# EasyEDA Pro project tumkibot1_servo_driver.eprj

# Schematic Schematic1
Board Name: Board1; Create Date: 2025-09-21; Page Name: P1; Project Name: tumkibot1_servo_driver; Schematic Name: Schematic1; Update Date: 2025-09-22; Company: EasyEDA.com; Page Size: A4; Version: V1.0
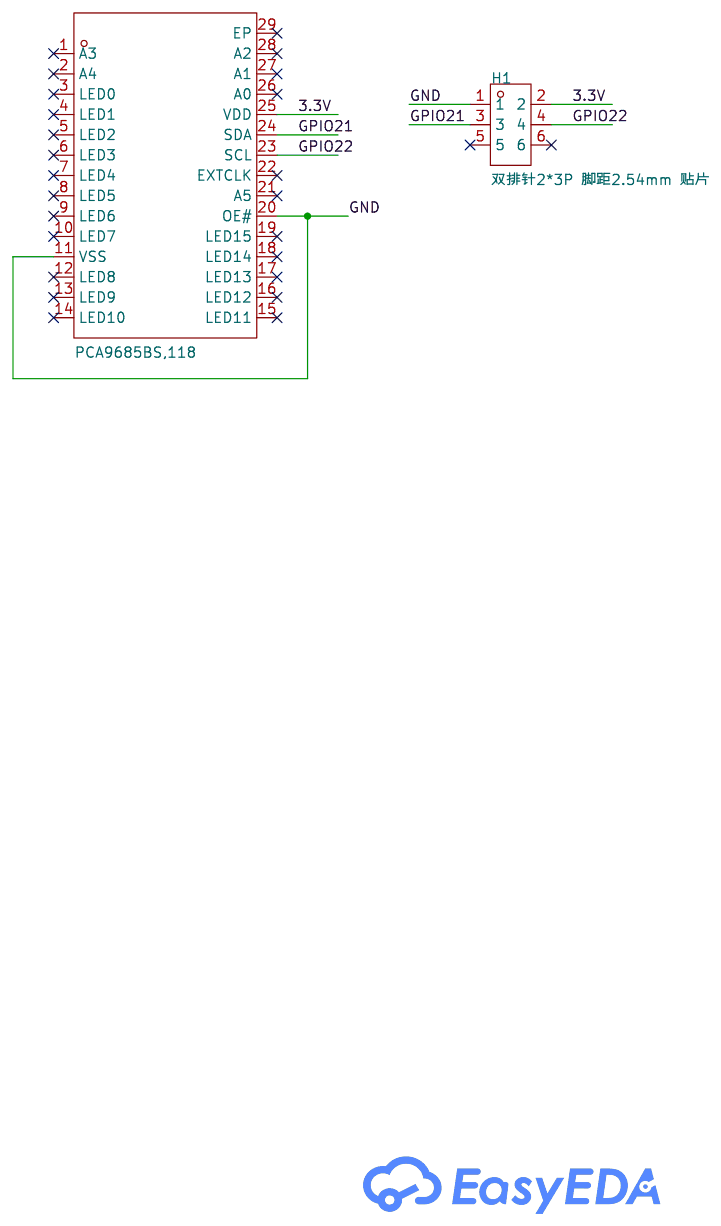
[diagram p0: schematic sheet]

## Parts
H1  双排针2*3P 脚距2.54mm 贴片  [HDR-SMD_6P-P2.54-V-M-R2-C3-S2.54-LS7.4]
U1  PCA9685BS,118  [QFN-28_L6.0-W6.0-P0.65-TL-EP4.1]

## Library data of the parts
H1 = 双排针2*3P 脚距2.54mm 贴片: LCSC Part Name: 间距:2.54mm; Supplier Part: C77761; Manufacturer: BOOMELE(博穆精密); Supplier Footprint: SMD,P=2.54mm; JLCPCB Part Class: Extended Part; Supplier: LCSC; Pitch: 2.54mm; Row Spacing: 2.54mm; Number of Rows: 2; Number of Pins: 6P; Color: Black
U1 = PCA9685BS,118: LCSC Part Name: 16通道、12位PWM Fm+ I2C总线LED控制器; Supplier Part: C5191634; Manufacturer: NXP(恩智浦); Supplier Footprint: HVQFN-28(6x6); JLCPCB Part Class: Extended Part; Datasheet: https://www.nxp.com.cn/docs/en/data-sheet/PCA9685.pdf; Supplier: LCSC; Voltage - Input(DC): 2.3V~5.5V; Number of Channels: 16; Output Current: 25mA; Dimming: PWM；I2C; Operating temperature: -40℃~+85℃

## Nets
3.3V: H1.2 U1.25(VDD)
GND: H1.1 U1.11(VSS) U1.20(OE#)
GPIO21: H1.3 U1.24(SDA)
GPIO22: H1.4 U1.23(SCL)

Not connected (* = marked no-connect by the designer): H1 5* 6*; U1 1(A3)* 2(A4)* 3(LED0)* 4(LED1)* 5(LED2)* 6(LED3)* 7(LED4)* 8(LED5)* 9(LED6)* 10(LED7)* 12(LED8)* 13(LED9)* 14(LED10)* 15(LED11)* 16(LED12)* 17(LED13)* 18(LED14)* 19(LED15)* 21(A5)* 22(EXTCLK)* 26(A0)* 27(A1)* 28(A2)* 29(EP)*

# Board PCB1
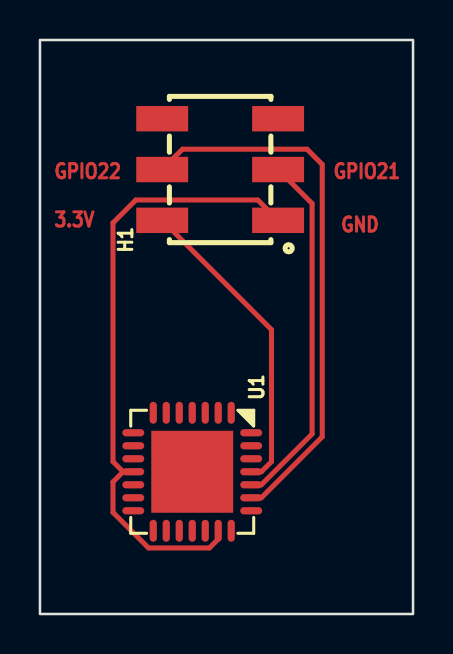
[diagram p1: board, top side]
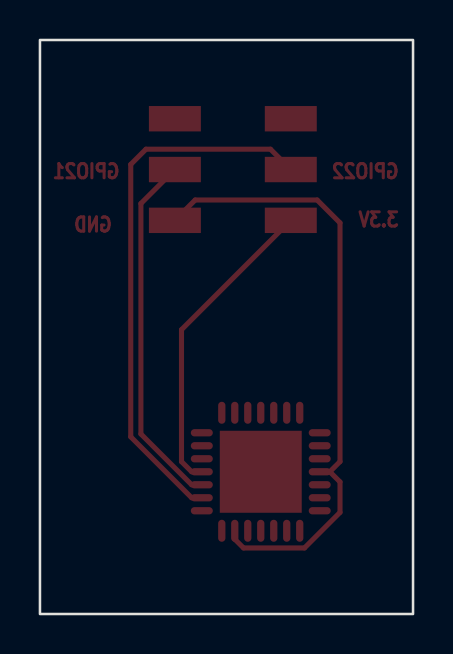
[diagram p2: board, bottom side, seen from below]

Outline 18.67 x 28.7 mm; copper layers: Top Layer, Bottom Layer. Coordinates in mm from the lower left corner of the outline.
Outline path: rectangle 0,28.7 18.67,0
Stack: Top Layer 0.035mm / Dielectric1 1.51mm FR4 er 4.5 / Bottom Layer 0.035mm

## Design rules (mm)
template: JLCPCB Capability(Two Layers Board)
spacing copperThickness1oz (default): track to track 0.102, other pairs 0.152 to 0.3
spacing copperThickness2oz: track to track 0.203, other pairs 0.152 to 0.3
track width copperThickness1oz (default): min 0.127, default 0.254, max 2.54
track width copperThickness2oz: min 0.203, default 0.254, max 2.54
differential pair differentialPair (default): width min 0.127, default 0.254, max 2.54; gap min 0.152, default 0.152
via viaSize (default): diameter min 0.5, default 0.61, max 10; hole min 0.3, default 0.305, max 6.3

## Placement (name value [footprint] x y rotation side)
H1  双排针2*3P 脚距2.54mm 贴片  [HDR-SMD_6P-P2.54-V-M-R2-C3-S2.54-LS7.4]  9.02 22.22 90 top
U1  PCA9685BS,118  [QFN-28_L6.0-W6.0-P0.65-TL-EP4.1]  7.62 7.11 270 top

## Footprints (pads in the part's own frame, mm; a bottom-side part is the same pattern mirrored in y, then rotated)
HDR-SMD_6P-P2.54-V-M-R2-C3-S2.54-LS7.4
  rect 1.27x2.6 smd: 1(-2.54,-2.9) 2(-2.54,2.9) 3(0,-2.9) 4(0,2.9) 5(2.54,-2.9) 6(2.54,2.9)
QFN-28_L6.0-W6.0-P0.65-TL-EP4.1
  oval 1.1x0.364 smd: 1(-2.95,1.95) 2(-2.95,1.3) 3(-2.95,0.65) 4(-2.95,0) 5(-2.95,-0.65) 6(-2.95,-1.3) 7(-2.95,-1.95) 15(2.95,-1.95) 16(2.95,-1.3) 17(2.95,-0.65) 18(2.95,0) 19(2.95,0.65) 20(2.95,1.3) 21(2.95,1.95)
  oval 0.364x1.1 smd: 8(-1.95,-2.95) 9(-1.3,-2.95) 10(-0.65,-2.95) 11(0,-2.95) 12(0.65,-2.95) 13(1.3,-2.95) 14(1.95,-2.95) 22(1.95,2.95) 23(1.3,2.95) 24(0.65,2.95) 25(0,2.95) 26(-0.65,2.95) 27(-1.3,2.95) 28(-1.95,2.95)
  rect 4.1x4.1 smd: 29(0,0)

## Nets
As in the schematic.

Pads without a net: H1 5 6; U1 1 2 3 4 5 6 7 8 9 10 12 13 14 15 16 17 18 19 21 22 26 27 28 29

## Routing (per net, layer and track width the routed paths; a pad name or vN(x,y) marks a point on that pad's centre or on a via; arc(x,y) is an arc through that point)
3.3V: length 15.6
  Top Layer w0.254: 6.12,19.69 11.59,14.22 11.59,7.62 11.08,7.11 U1.25
GND: length 31.2
  Top Layer w0.254: U1.20 8.92,3.74 8.48,3.3 5.43,3.3 3.65,5.08 3.65,6.6 4.16,7.11 ; 4.16,7.11 3.65,7.62 3.65,19.56 4.8,20.7 10.9,20.7 11.92,19.69 ; 4.16,7.11 U1.11
GPIO21: length 18
  Top Layer w0.254: U1.24 11.08,6.46 13.62,9 13.62,20.52 H1.3
GPIO22: length 27.2
  Top Layer w0.254: H1.4 7.13,23.24 13.36,23.24 14.13,22.48 14.13,8.86 11.08,5.81 U1.23

## Text on the board
Top Layer: GPIO22 | 3.3V | GPIO21 | GND
